# EAGLE design TrinketBlinkM0E (EAGLE 8.4.3)
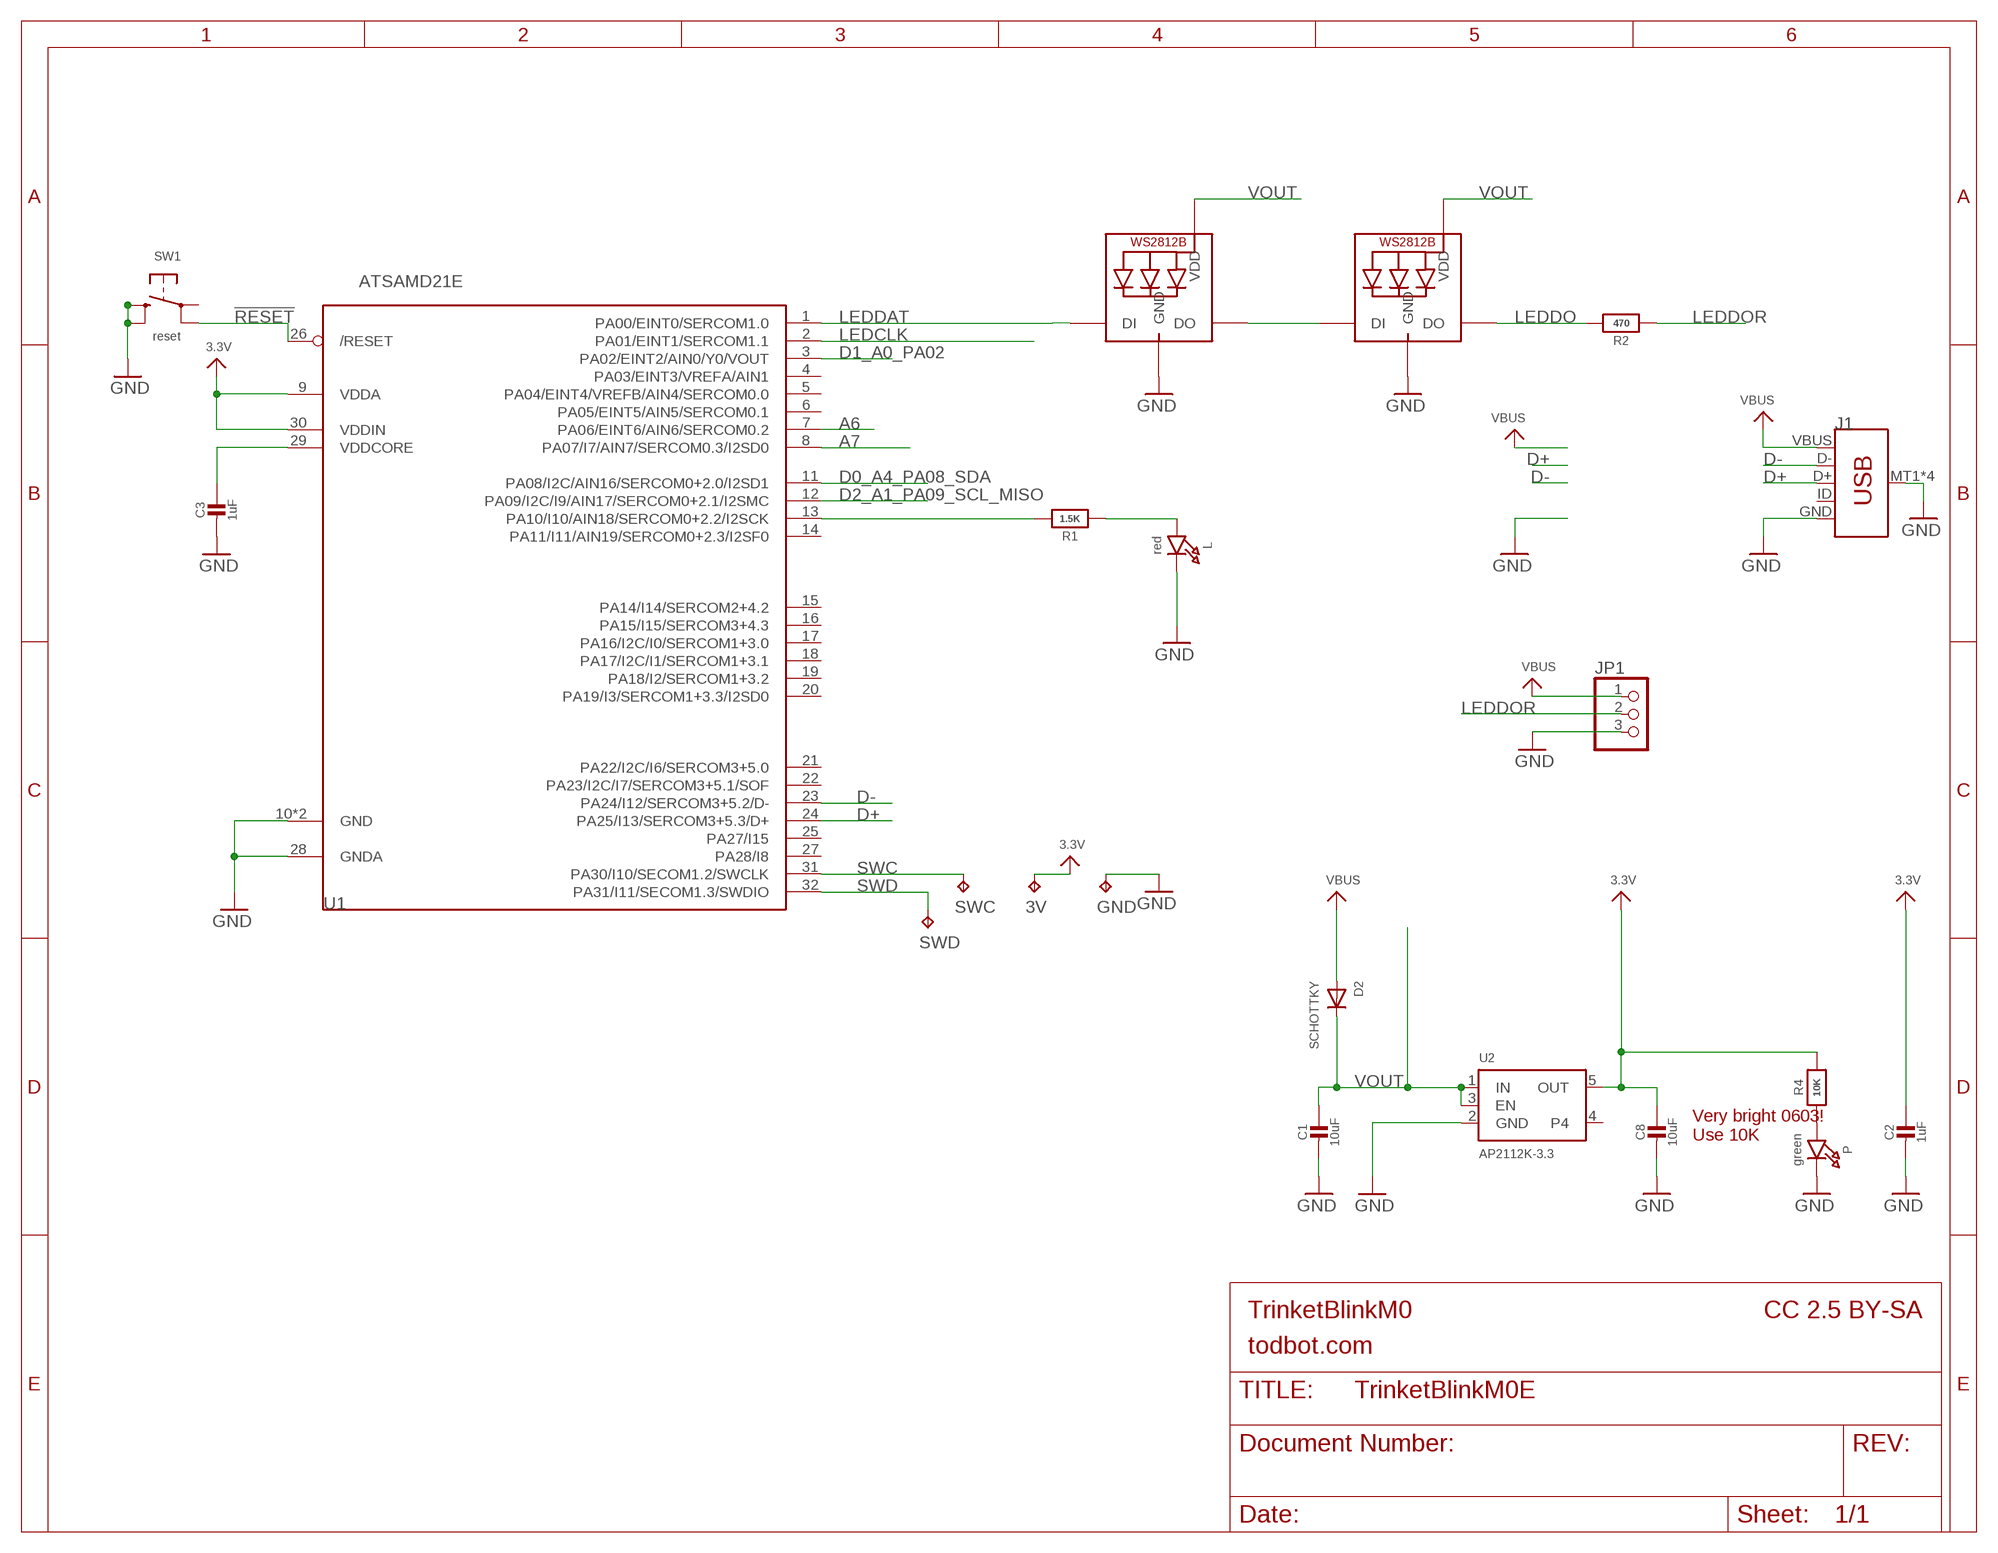
[diagram p0: schematic, sheet 1]

## Parts
3V  TPB1,27  [B1,27]
C1  10uF  CAP_CERAMIC0805-NOOUTLINE  [0805-NO]
C2  1uF  CAP_CERAMIC0603_NO  [0603-NO]
C3  1uF  CAP_CERAMIC0603_NO  [0603-NO]
C8  10uF  CAP_CERAMIC0805-NOOUTLINE  [0805-NO]
D2  SCHOTTKY  DIODE_SOD-123FL  [SOD-123FL]
GND  TPB1,27  [B1,27]
J1  USB_MICRO-B_SMT  [USB-MICROB]
JP1  PINHD-1X3CB  [1X03-CLEANBIG]
L  red  LED0603_NOOUTLINE  [CHIPLED_0603_NOOUTLINE]
LED1  WS2812B_5050N  [WS2812B-NARROW]
LED2  WS2812B_5050N  [WS2812B-NARROW]
P  green  LED0603_NOOUTLINE  [CHIPLED_0603_NOOUTLINE]
R1  1.5K  RESISTOR_0603_NOOUT  [0603-NO]
R2  470  RESISTOR_0603_NOOUT  [0603-NO]
R4  10K  RESISTOR_0603_NOOUT  [0603-NO]
SW1  reset  SWITCH_TACT_SMT4.6X2.8  [BTN_KMR2_4.6X2.8]
SWC  TPB1,27  [B1,27]
SWD  TPB1,27  [B1,27]
U1  ATSAMD21E  [QFN32_5MM]
U2  AP2112K-3.3  VREG_SOT23-5  [SOT23-5]

## Nets
3.3V: 3V.TP C2.1 C8.1 R4.2 U1.9(VDDA) U1.30(VDDIN) U2.5(OUT)
!RESET: SW1.A'(P1) U1.26(/RESET)
A6: U1.7(PA06/EINT6/AIN6/SERCOM0.2)
A7: U1.8(PA07/I7/AIN7/SERCOM0.3/I2SD0)
D0_A4_PA08_SDA: U1.11(PA08/I2C/AIN16/SERCOM0+2.0/I2SD1)
D1_A0_PA02: U1.3(PA02/EINT2/AIN0/Y0/VOUT)
D2_A1_PA09_SCL_MISO: U1.12(PA09/I2C/I9/AIN17/SERCOM0+2.1/I2SMC)
D+: J1.D+ U1.24(PA25/I13/SERCOM3+5.3/D+)
D-: J1.D- U1.23(PA24/I12/SERCOM3+5.2/D-)
GND: C1.2 C2.2 C3.2 C8.2 GND.TP J1.GND J1.MT1(SHIELD) J1.MT2(SHIELD) J1.P$1(SHIELD) J1.P$2(SHIELD) JP1.3 L.C LED1.3-GND(GND) LED2.3-GND(GND) P.C SW1.B'(S1) SW1.B(S) U1.10(GND) U1.28(GNDA) U1.33(GND) U2.2(GND)
LEDCLK: U1.2(PA01/EINT1/SERCOM1.1)
LEDDAT: LED1.4-DIN(DI) U1.1(PA00/EINT0/SERCOM1.0)
LEDDO: LED2.2-DOUT(DO) R2.2
LEDDOR: JP1.2 R2.1
N$1: L.A R1.1
N$2: R1.2 U1.13(PA10/I10/AIN18/SERCOM0+2.2/I2SCK)
N$3: LED1.2-DOUT(DO) LED2.4-DIN(DI)
N$6: P.A R4.1
SWC: SWC.TP U1.31(PA30/I10/SECOM1.2/SWCLK)
SWD: SWD.TP U1.32(PA31/I11/SECOM1.3/SWDIO)
VBUS: D2.A J1.VBUS JP1.1
VDDCORE: C3.1 U1.29(VDDCORE)
VOUT: C1.1 D2.C LED1.1-VDD(VDD) LED2.1-VDD(VDD) U2.1(IN) U2.3(EN)
Unconnected: J1.ID SW1.A(P) U1.4(PA03/EINT3/VREFA/AIN1) U1.5(PA04/EINT4/VREFB/AIN4/SERCOM0.0) U1.6(PA05/EINT5/AIN5/SERCOM0.1) U1.14(PA11/I11/AIN19/SERCOM0+2.3/I2SF0) U1.15(PA14/I14/SERCOM2+4.2) U1.16(PA15/I15/SERCOM3+4.3) U1.17(PA16/I2C/I0/SERCOM1+3.0) U1.18(PA17/I2C/I1/SERCOM1+3.1) U1.19(PA18/I2/SERCOM1+3.2) U1.20(PA19/I3/SERCOM1+3.3/I2SD0) U1.21(PA22/I2C/I6/SERCOM3+5.0) U1.22(PA23/I2C/I7/SERCOM3+5.1/SOF) U1.25(PA27/I15) U1.27(PA28/I8) U2.4

## Notes on the sheet
- Very bright 0603!
  Use 10K
- TrinketBlinkM0 | CC 2.5 BY-SA
- todbot.com

## Library data of the parts
3V GND SWC SWD = testpad:TP: Test pad
C1-C3 C8 = microbuilder:CAP_CERAMIC: Ceramic Capacitors For new designs, use the packages preceded by an '_' character since they are more reliable: The following footprints should be used on most boards: _0402 - Standard footprint for regular board layouts _0603 - Standard footprint for regular board layouts _0805 - Standard footprint for regular board layouts _1206 - Standard footprint for regular board layouts For extremely tight-pitch boards where space is at a premium, the following 'micro-pitch' footprints can be used (smaller pads, no silkscreen outline, etc.): _0402MP - Micro-pitch footprint for very dense/compact boards _0603MP - Micro-pitch footprint for very dense/compact boards _0805MP - Micro-pitch footprint for very dense/compact boards _1206MP - Micro-pitch footprint for very dense/compact boards
D2 = adafruit:DIODE: Diode SMADIODE - SMA Surface Mount Package 20V 1A Schottky Diode Digikey: 641-1014-6-ND DO-1N4148 - Through Hole Small Current Diode SOD-123 20V 1 A (.5mV Vf) Schottky Diode - Digikey: MBRX120TPMSCT-ND SOD-323 10V 570mA (.38mV Vf, 3ns) Schottky Diode - Digikey: ZLLS410CT-ND SOD-523 30V 30mA Schottky Diode (RB751S-40TE61) - Digikey: RB751S-40TE61CT-ND SOT23-R/W - SOT23 Package (R = Solder Paste/Reflow Ovens, W = Hand-Soldering) BAT54Film 40V 300mA - Digikey: 497-7162-1-ND
J1 = SparkFun-Connectors:USB_MICRO-B: USB Type Micro-B Connector Male/female and PTH/SMT variants SparkFun Products: SparkFun microB USB Breakout <https://www.sparkfun.com/products/12035> SparkFun USB microB Plug Breakout <https://www.sparkfun.com/products/10031> SparkFun ESP8266 Thing <https://www.sparkfun.com/products/13231>; PROD_ID: CONN-09505; SF_ID: PRT-08533
JP1 = adafruit:PINHD-1X3: PIN HEADER
L P = microbuilder:LED: LED 0603 - 0603 Surface Mount Package 2mA: Green LED - Low Power (3.9mcd, 2ma, 1.7Vf) - Digikey: 475-2709-2-ND Orange LED - Low Power (9.8mcd, 2ma, 1.8Vf) - Digikey: 475-1194-2-ND Red LED - Low Power (5mcd, 2ma, 1.8Vf) - Digikey: 475-1195-2-ND Yellow LED - Low Power (7mcd, 2ma, 1.8Vf) - Digikey: 475-1196-2-ND 5mA: Blue LED - Low Power (17mcd, 5ma, 2.9Vf) - Digikey: LNJ937W8CRACT-ND 0805 - 0805 Surface Mount Package 2mA: Red LED (8.8mcd, 2mA, 1.8Vf, Clear) - Low Power [Digikey: 475-2510-1-ND] Green LED (5mcd, 2mA, 1.8Vf, Clear) - Low Power [Digikey: 475-2730-1-ND] Yellow LED (11.3mcd, 2mA, 1.8Vf, Clear) - Low Power [Digikey: 475-2555-1-ND] 20mA: Red LED (104mcd, 20mA, Diffused) - LS R976 [Digikey: 475-1278-6-ND] Red LED (12mcd, 20mA, 2.0Vf, Clear) - APT2012EC [Digikey: 754-1128-1-ND] Green LED (15mcd, 20mA, 2.2Vf, Clear) - APT2012GC [Digikey: 754-1131-1-ND] Orange LED (160mcd, 20mA, 2.1Vf, Clear) - APT2012SECK [Digikey: 754-1130-1-ND] 1206 - 1206 Surface Mount Package Green LED (26mcd, 20mA, Diffused) - LG N971 [Digikey: 475-1407-6-ND] Red LED (15mcd, 20mA, Diffused) - LH N974 [Digikey: 475-1416-6-ND] Cree - Cree High-Power Surface Mount LEDs XPEBWT-L1-0000-00D50 - White 111lm 350mA 2.9Vf 6200K 110° XTEAWT-00-0000-00000LEE3 - White 114lm 350mA 2.85Vf 5000K 115° Everlight - Everlight 45-21 Series Surface Mount LEDs 45-21/QK2C-B2832AC2CB2/2T - Warm White 2000mcd 20mA 3.25Vf 3050K 120° 45-21/LK2C-B38452C4CB2/2T - Nuetral White 2000mcd 20mA 3.25Vf 4150K 120° 45-21/LK2C-B50634C6CB2/2T - Cold White 2200mcd 20mA 3.25Vf 5650K 120° PLCC2 Reverse Mount LS T77K-J1L2-1-0-2-R18-Z - Red 11.25mcd 2mA 1.8Vf 630nm 120° LO T77K-L1M2-24-Z - Orange 19.6mcd 2mA 1.8Vf 606nm 120° LY T77K-K2M1-26-Z - Yellow 15.7mcd 2mA 1.8Vf 587nm 120°
LED1 LED2 = adafruit:WS2812B
R1 R2 R4 = microbuilder:RESISTOR: Resistors For new designs, use the packages preceded by an '_' character since they are more reliable: The following footprints should be used on most boards: _0402 - Standard footprint for regular board layouts _0603 - Standard footprint for regular board layouts _0805 - Standard footprint for regular board layouts _1206 - Standard footprint for regular board layouts For extremely tight-pitch boards where space is at a premium, the following 'micro-pitch' footprints can be used (smaller pads, no silkscreen outline, etc.): _0402MP - Micro-pitch footprint for very dense/compact boards _0603MP - Micro-pitch footprint for very dense/compact boards _0805MP - Micro-pitch footprint for very dense/compact boards _1206MP - Micro-pitch footprint for very dense/compact boards
SW1 = microbuilder:SWITCH_TACT_SMT: SMT Tact Switches 6x6mm - Digikey: P12940SCT-ND KMR2 (4.6x2.8mm) - Digikey: 401-1426-1-ND EVQ-PQHB55 - Light Touch, 160GF (4.5x4.5mm) - Digikey: P8090SCT-ND KMT0 - KMT021 NGJ LHS (etc.) IP68/Waterproof - Digikey: CKN10289CT-ND
U1 = microbuilder:ATSAMD21E
U2 = microbuilder:VREG_SOT23-5: SOT23-5 Fixed Voltage Regulators Part Current Out V Out V In V Dropout θJA (°C/W) TJ (°C) Digikey Part No. ADP121 150mA 3.3V 3.4-5.5V 0.09V @ 150mA -- -- ADP121-AUJZ33R7CT-ND ADP121 150mA 3.0V 3.1-5.5V 0.09V @ 150mA -- -- ADP121-AUJZ30R7CT-ND ADP122 300mA 3.3V 3.4-5.5V 0.085V @ 300mA -- -- ADP122AUJZ-3.3-R7CT-ND ADP1712 300mA 3.3V 3.5-5.5V 0.17V @ 300mA -- -- ADP1712AUJZ-3.3-R7TR-ND AP7311 (Low Cost) 150mA 3.3V 3.5-6V 0.15V @ 150mA -- -- AP7311-33WG-7DICT-ND LD39015M18R 150mA 1.8V 1.9V-5.5V 0.08V @ 100mA -- -- 497-6977-1-ND LP2985A-33DBVR 150mA 3.3V 3.3-16V 0.28V @ 150mA 206 150 296-18479-1-ND MCP1824T-3302E/OT 300mA 3.3V 3.5V-6V 0.2V @ 300mA -- -- MCP1824T-3302E/OTCT-ND MIC5205-2.5YM5 TR 150mA 2.5V 2.7-16V 0.165V @ 150mA -- -- 576-1257-2-ND MIC5205-3.0YM5 TR 150mA 3.0V 3.2V-16V 0.165V @ 150mA -- -- 576-1258-2-ND MIC5205-3.3YM5 TR 150mA 3.3V 3.5V-16V 0.165V @ 150mA -- -- 576-1259-2-ND TPS780330220 150mA 3.3V+2.2V 3.6-5.5V 250mV Max -- -- 296-23332-1-ND TDA3663/N1,135 100mA 3.3V 3.5-45V 0.18V @ 50mA -- -- 568-5343-1-ND Max operating temp can be calculated using θJA, TJ (max junction temperature), and power in watts. Set the "Maximum Ambient Temperature" until it reaches TJ ("Max Junction Temperature"), which is the absolute limit for safe use of the regulator: Heat Sink Temperature Calculator <http://www.daycounter.com/Calculators/Heat-Sink-Temperature-Calculator.phtml> For example, With 12V source into a 3.3V LP2985 and a 30mA load, we are dissipating (12V-3.3V) * 0.03A = 0.261W. With a θJA of 206 °C/W, a TJ of 150°C, and 261mW we can safely use the chip without a heat sink up to 75°C (=147.1°C Junction Temperature).

## Net classes
1 power: width 0.305 mm

## Board
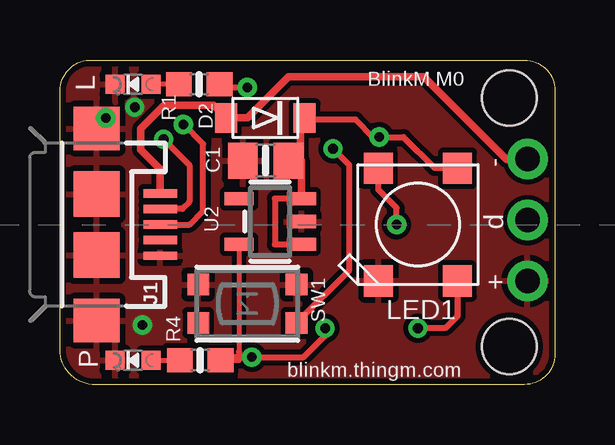
[diagram p1: board, top side]
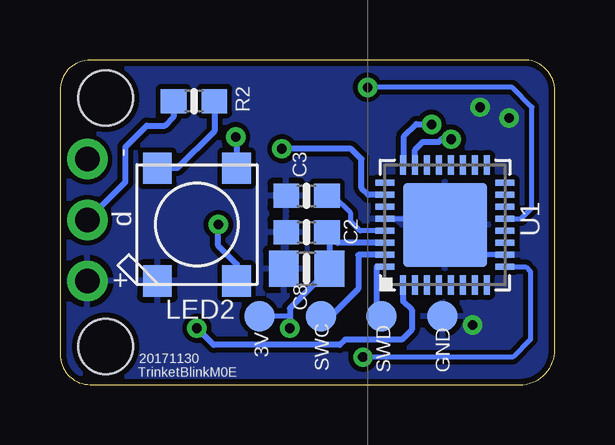
[diagram p2: board, bottom side, seen from below]

Size 20.64 x 13.53 mm. Coordinates in mm from the lower left corner, seen from the top.
Outline: 1.21,13.53 18.29,13.53 19.37,13.53 arc-90 20.64,12.26 20.64,1.27 arc-90 19.37,0 18.93,0 1.34,0 arc-90 0.01,1.59 0.01,3.87 0.01,4.32 0.01,9.14 0.01,9.46 0.01,12.13 arc-90 1.21,13.53
Copper layers (1*16): Top 0.035mm / dielectric 1.5mm / Bottom 0.035mm
Design rules "adafruit *": minimum track width 8mil, minimum drill 15.5mil, track to track 8mil, track to pad 8mil, pad to pad 8mil, via to via 8mil, smd to smd 8mil, copper to edge 10mil, drill to drill 8mil, minimum pad ring 10mil, minimum via ring 8mil, stop-mask expansion 2mil, vias tented up to drill 20mil, thermal gap 10mil
Holes 2.29 mm at 18.74,1.59 18.74,11.94

### Footprints (pad centres in the part's own frame; a part is rotated, then mirrored left to right if it is on the bottom)
B1,27 = smd 1.27 x 1.27: TP 0,0
0805-NO = smd 1.24 x 1.5: 1 -0.95,0; 2 0.95,0
0603-NO = smd 1.075 x 1: 1 -0.85,0; 2 0.85,0
SOD-123FL = smd 0.91 x 1.22: A 1.637,0; C -1.637,0
USB-MICROB = smd 1.4 x 0.35: D+ -2.65,0; D- -2.65,-0.65; GND -2.65,1.3; ID -2.65,0.65; VBUS -2.65,-1.3 | smd 1.9 x 1.8: MT1 0,-4; MT2 0,4 | smd 1.9 x 1.9: P$1 0,-1.27; P$2 0,1.27
1X03-CLEANBIG = drill 1.016 pad 1.676: 1 -2.54,0; 2 0,0; 3 2.54,0
CHIPLED_0603_NOOUTLINE = smd 0.8 x 0.8: A 0,-0.75; C 0,0.75
WS2812B-NARROW = smd 1.3 x 1.2: 1-VDD 2.35,-1.65; 2-DOUT 2.35,1.65; 3-GND -2.35,1.65; 4-DIN -2.35,-1.65
BTN_KMR2_4.6X2.8 = smd 0.9 x 0.9: A 2.05,0.8; A' -2.05,0.8; B 2.05,-0.8; B' -2.05,-0.8
QFN32_5MM = smd 0.8 x 0.25: 1 -2.5,1.75; 2 -2.5,1.25; 3 -2.5,0.75; 4 -2.5,0.25; 5 -2.5,-0.25; 6 -2.5,-0.75; 7 -2.5,-1.25; 8 -2.5,-1.75; 17 2.5,-1.75; 18 2.5,-1.25; 19 2.5,-0.75; 20 2.5,-0.25; 21 2.5,0.25; 22 2.5,0.75; 23 2.5,1.25; 24 2.5,1.75 | smd 0.25 x 0.8: 9 -1.75,-2.5; 10 -1.25,-2.5; 11 -0.75,-2.5; 12 -0.25,-2.5; 13 0.25,-2.5; 14 0.75,-2.5; 15 1.25,-2.5; 16 1.75,-2.5; 25 1.75,2.5; 26 1.25,2.5; 27 0.75,2.5; 28 0.25,2.5; 29 -0.25,2.5; 30 -0.75,2.5; 31 -1.25,2.5; 32 -1.75,2.5 | smd 3.5 x 3.5: 33 0,0
SOT23-5 = smd 0.55 x 1.2: 1 -0.95,-1.3; 2 0,-1.3; 3 0.95,-1.3; 4 0.95,1.3; 5 -0.95,1.3

### Placement (x,y rotation side)
3V  12.32,2.86 270 bottom
C1  8.58,9.33 180 top
C2  10.36,6.35 180 bottom
C3  10.36,7.87 180 bottom
C8  10.36,4.83 180 bottom
D2  8.57,11.11 180 top
GND  4.7,2.86 270 bottom
J1  1.53,6.67 180 top
JP1  19.5,6.86 270 top
L  3.05,12.51 90 top
LED1  14.93,6.67 90 top
LED2  14.93,6.67 90 bottom
P  3.05,1.02 90 top
R1  5.81,12.51 0 top
R2  15.05,11.81 0 bottom
R4  5.85,1.02 0 top
SW1  7.82,3.37 180 top
SWC  9.76,2.86 270 bottom
SWD  7.24,2.86 270 bottom
U1  4.59,6.65 90 bottom
U2  8.77,6.79 90 top
U$1  [TRINKET_M0_BOTTOM]  21.6,14.29 270 bottom
U$20  [TRINKET_M0_TOP]  21.6,-0.95 90 top

### Tracks (layer width: path | path; a pad name or v marks a point on that pad's centre or on a via)
3.3V  (via drill 0.4)
  Top 0.203: U2.5 7.47,1.36
  Top 0.254: 7.47,1.36 7.47,1.02 R4.2 6.82,1.14 v8.01,1.14 10.17,1.14 11.05,2.03 v11.05,2.35
  Bottom 0.203: v8.01,1.14 1.77,1.14 1.02,1.89 1.02,4.7 1.22,4.9 U1.9 | 3V.TP 11.05,2.86 v11.05,2.35
  Bottom 0.254: C2.1 9.38,6.35 | U1.30 9.06,5.9 C2.1 | C2.1 9.41,6.25 C8.1 11.05,3.18 v11.05,2.35 11.05,2.86
!RESET  (via drill 0.4)
  Top 0.254: SW1.A' 12.07,4.78 12.07,9.14 v11.39,9.83
  Bottom 0.254: U1.26 7.78,7.9 8.07,8.19 8.07,9.4 8.5,9.83 v11.39,9.83
D+  (via drill 0.4)
  Top 0.254: J1.D+ 5.4,6.67 5.97,7.24 5.97,10.02 v5.15,10.84
  Bottom 0.254: U1.24 6.29,9.2 6.29,10.35 5.78,10.86 5.16,10.86 v5.15,10.84
D-  (via drill 0.4)
  Top 0.254: v4.32,10.22 5.4,9.14 5.4,7.62 5.1,7.32 J1.D-
  Bottom 0.254: v4.32,10.22 4.73,10.22 4.85,10.11 5.5,10.11 5.84,9.78 U1.23
GND  (via drill 0.4)
  Bottom 0.203: U1.10 4.46,5.4 4.59,5.53 U1.33 4.59,7.18 4.89,7.18 4.89,6.9 U1.28
  other vias: 3.43,2.48 3.12,11.56 1.91,11.11
  pour Bottom: 0.01,-0.95 21.6,-0.95 21.6,14.29 0.01,14.29
  pour Top: -0.19,-1.4 21.4,-1.4 21.53,15.11 -0.06,15.11
LEDDAT  (via drill 0.4)
  Top 0.254: 16.58,4 LED1.4-DIN 16.58,2.86 16.07,2.35 v14.93,2.35
  Bottom 0.254: v14.93,2.35 14.23,1.65 8.98,1.65 8.75,1.88 6.38,1.88 5.97,2.29 5.97,3.11 6.34,3.47 U1.1
LEDDO
  Bottom 0.254: 14.21,11.79 R2.2 14.21,10.57 15.75,9.02 LED2.2-DOUT
LEDDOR
  Bottom 0.254: JP1.2 17.91,8.45 17.91,9.91 17.02,10.79 16.26,10.79 15.9,11.15 R2.1
N$1
  Top 0.203: R1.1 L.A
N$2  (via drill 0.4)
  Top 0.254: R1.2 6.79,12.38 v7.82,12.38
  Bottom 0.203: U1.13 1.42,6.9 0.96,7.37 0.96,11.56 1.78,12.38 v7.82,12.38
N$3  (via drill 0.4)
  Top 0.254: v14.04,6.67 14.04,7.37 13.28,8.13 LED1.2-DOUT
  Bottom 0.254: LED2.4-DIN 13.28,5.02 14.04,5.78 v14.04,6.67
N$6
  Top 0.203: P.A R4.1
SWC
  Bottom 0.254: U1.31 8.2,5.4 8.2,4 9.34,2.86 SWC.TP
SWD
  Bottom 0.254: U1.32 7.43,4.9 7.43,3.05 SWD.TP
VBUS
  Top 0.305: J1.VBUS 4.18,8.97 3.37,9.78 3.37,10.67 4.34,11.64 6.4,11.64 D2.A 7.82,11.11 9.53,12.83 15.18,12.83 15.21,12.79 18.61,9.4 JP1.1
VDDCORE
  Bottom 0.203: U1.29 8.12,6.4 8.51,6.79 8.51,7.14 9.25,7.87 C3.1
VOUT  (via drill 0.4)
  Top 0.254: D2.C 10.27,11.05 12.32,11.05 13.06,10.31 13.34,10.31 | LED1.1-VDD 15.63,9.02 14.33,10.31 13.34,10.31 | 13.34,10.31 v13.31,10.31 | U2.3 8.96,7.75 8.96,5.84 U2.1
  Top 0.305: D2.C 10.04,11.11 10.04,9.27 9.53,9.27 C1.1 10.07,9.34 U2.3
  Bottom 0.254: v13.31,10.31 13.28,10.28 LED2.1-VDD

### Text on the board
tPlace: BlinkM M0 | - | d | + | blinkm.thingm.com
bPlace: - | d | + | 20171130 | TrinketBlinkM0E